# Altium schematic sheet TIDA-010933-DCAC-AUX-Power.SchDoc
size A3; Date: Not shown in title block; ApprovedBy: Not shown in title block; CheckedBy: Not shown in title block; Author: Not shown in title block; CompanyName: Not shown in title block; Engineer: Not shown in title block; Organization: Not shown in title block; Address1: Not shown in title block; Address2: Not shown in title block; Address3: Not shown in title block; Address4: Not shown in title block; DocumentNumber: 1; Revision: Use project parameter SCH_Rev; SheetNumber: 10; SheetTotal: 11; PageSetup: Record=PageOptions|CenterHorizontal=True|CenterVertical=True|PrintScale=0.69|XCorrection=1.00|YCorrection=1.00|PrintKind=0|BorderSize=5000000|LeftOffset=0|BottomOffset=0|Orientation=2|PaperLength=1000|PaperWidth=1000|Scale=100|PaperSource=15|PrintQuality=600|MediaType=1|DitherType=10|PaperKind=Letter|PrintScaleMode=1; CurrentTime: Not shown in title block; CurrentDate: Not shown in title block; Time: Not shown in title block; DocumentFullPathAndName: Not shown in title block; DocumentName: Not shown in title block; ModifiedDate: Not shown in title block; ImagePath: Not shown in title block
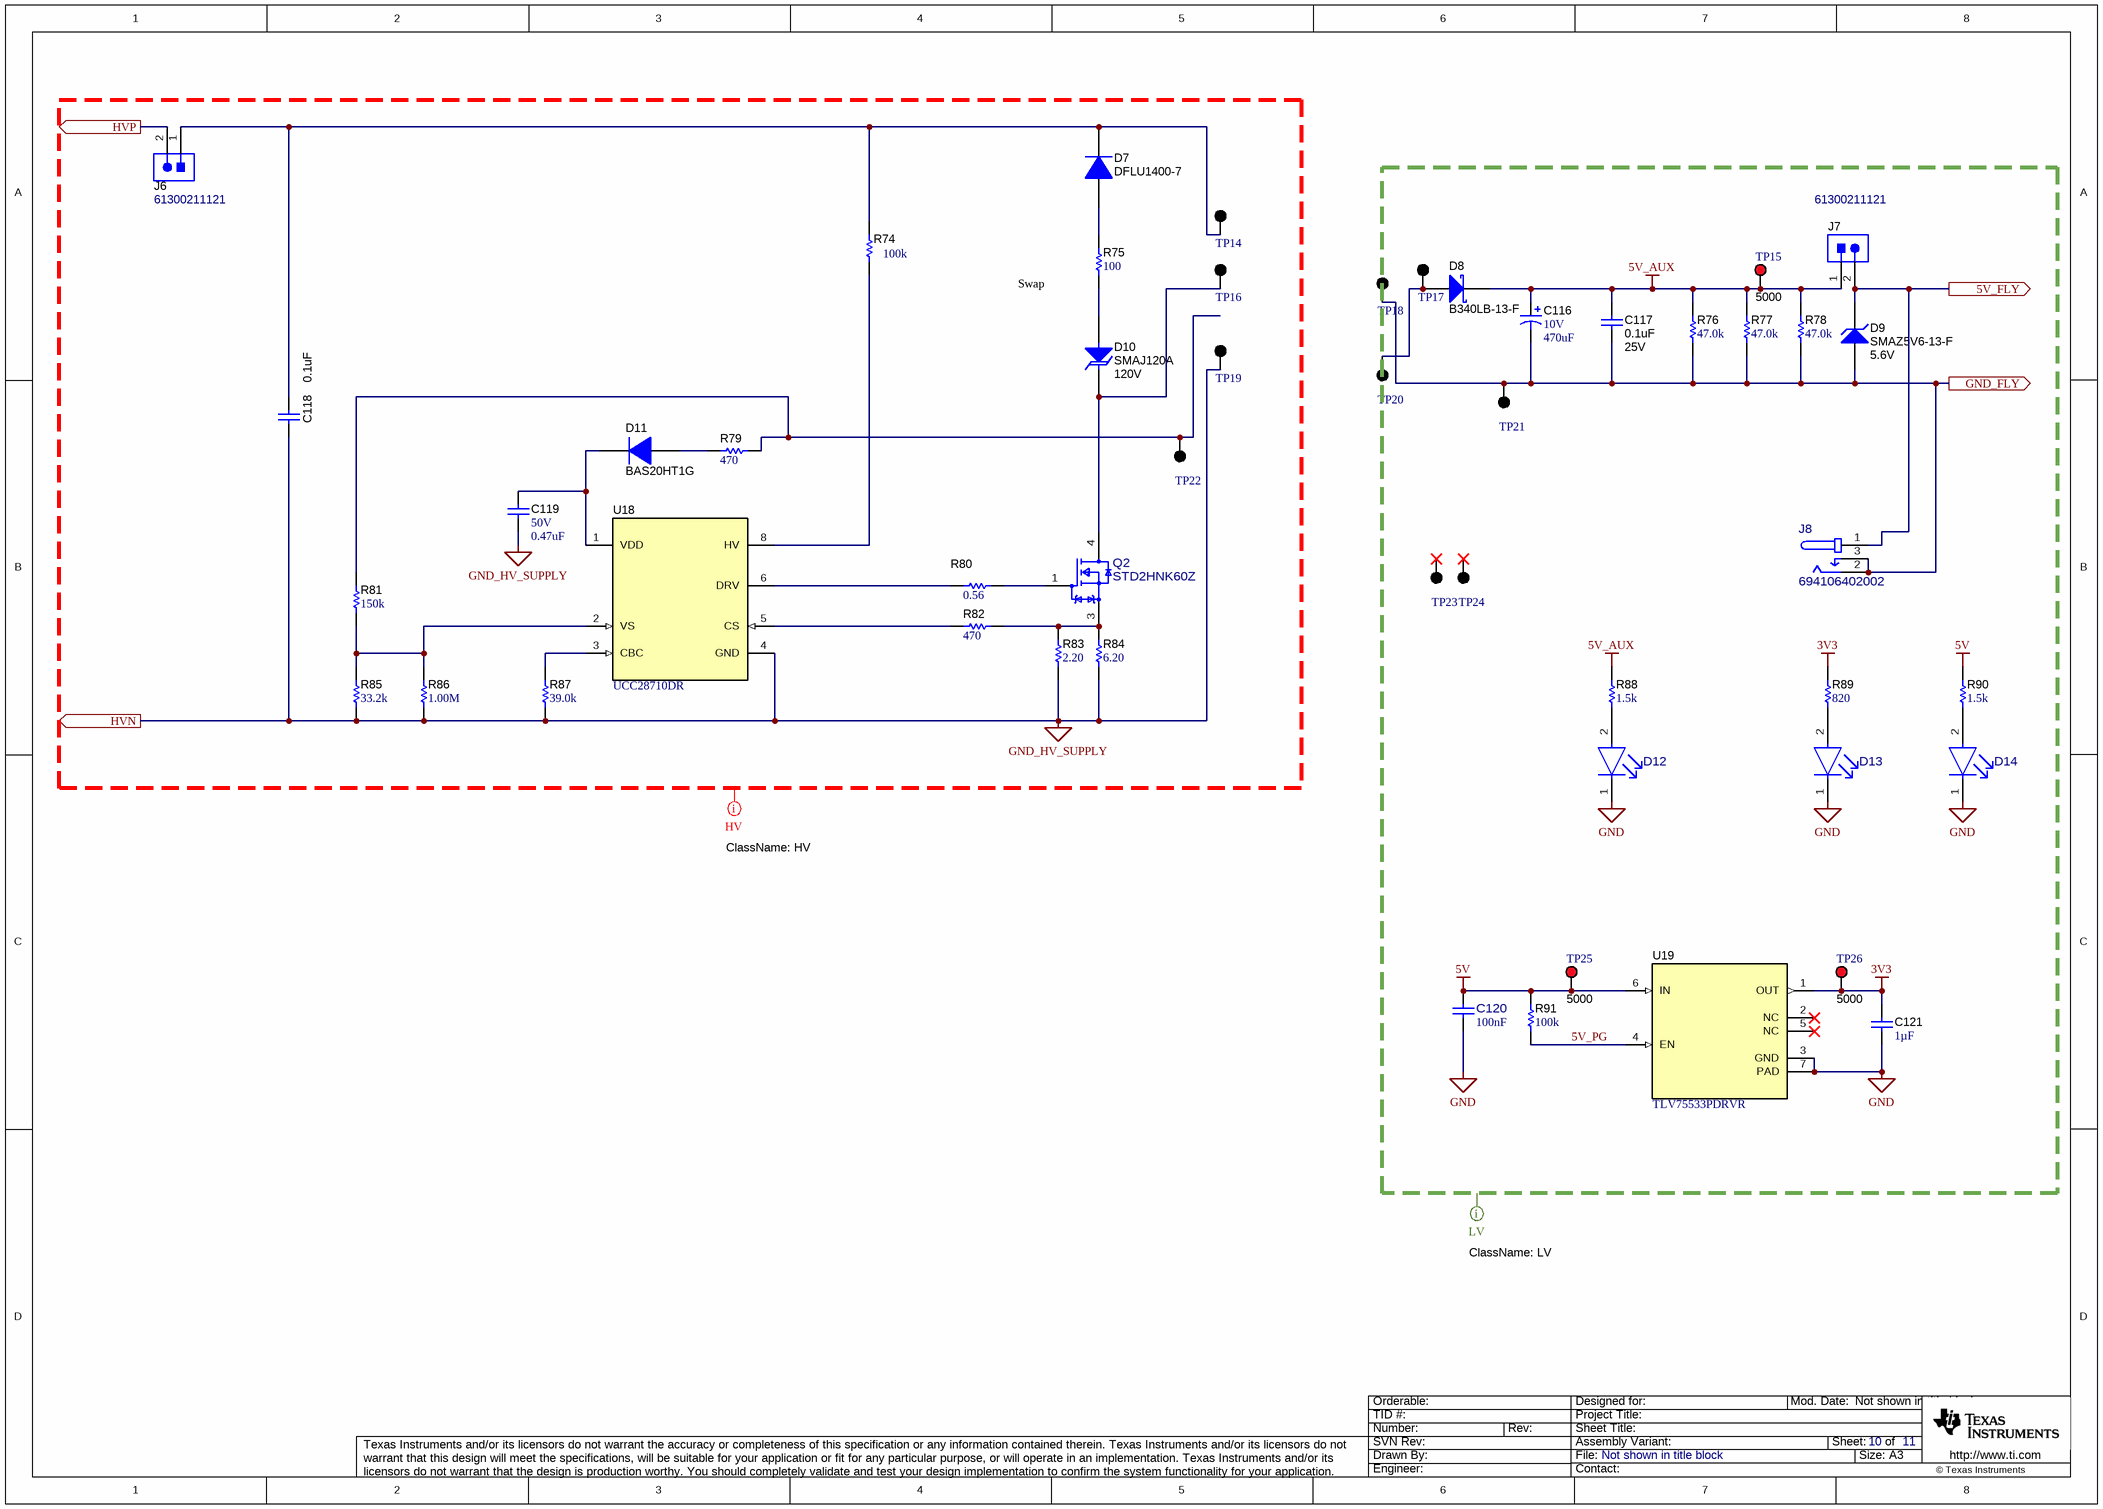
[diagram p0: TIDA-010933-DCAC-AUX-Power.SchDoc]

## Parts
C116  VDC_V: 10V  ValueDisplayed: 470uF  [7343-43]  (hidden comment: TPSE477M010R0045)
C117  ValueDisplayed: 0.1uF  VDC_V: 25V  [0603]  (hidden comment: C0603X104K3RACTU)
C118  ValueDisplayed: 0.1uF  [1812_254]  (hidden comment: C1812W104KDRACTU)
C119  VDC_V: 50V  ValueDisplayed: 0.47uF  [0805_HV]  (hidden comment: C2012X6S1H474K125AB)
C120  Cap_F: 100nF  [FP-CL10B104KB8NNNC_0603-IPC_B]  (hidden comment: CL10B104KB8NNNC)
C121  Cap_F: 1µF  [0603]  (hidden comment: 885012206026)
D7  DFLU1400-7  [PowerDI123]
D8  B340LB-13-F  [SMB]
D9  SMAZ5V6-13-F  value 5.6V  [SMA]
D10  SMAJ120A  value 120V  [SMA]
D11  BAS20HT1G  [SOD-323]
D12  KG DELLS1.22-JGKH-24  [FP-KG DELLS1.22-JGKH-24_0603-MFG]  (value not drawn)
D13  KG DELLS1.22-JGKH-24  [FP-KG DELLS1.22-JGKH-24_0603-MFG]  (value not drawn)
D14  KG DELLS1.22-JGKH-24  [FP-KG DELLS1.22-JGKH-24_0603-MFG]  (value not drawn)
J6  61300211121  [WURTH_61300211121]
J7  61300211121  [WURTH_61300211121]
J8  694106402002  [FP-694106402002_CONN_PWR_10MM7_9MM0-MFG]
Q2  STD2HNK60Z  [FP-STD2HNK60Z_DPAK-MFG]
R74  ValueDisplayed: 100k  [0805_HV]  (hidden comment: CRCW0805100KFKEA)
R75  ValueDisplayed: 100  [0805_HV]  (hidden comment: CRCW0805100RFKEA)
R76  ValueDisplayed: 47.0k  [0603]  (hidden comment: RC0603FR-0747KL)
R77  ValueDisplayed: 47.0k  [0603]  (hidden comment: RC0603FR-0747KL)
R78  ValueDisplayed: 47.0k  [0603]  (hidden comment: RC0603FR-0747KL)
R79  ValueDisplayed: 470  [0603]  (hidden comment: CRCW0603470RJNEA)
R80  ValueDisplayed: 0.56  [0603]  (hidden comment: RCWE0603R560FKEA)
R81  ValueDisplayed: 150k  [0603]  (hidden comment: RC0603FR-07150KL)
R82  ValueDisplayed: 470  [0603]  (hidden comment: RC0603FR-07470RL)
R83  ValueDisplayed: 2.20  [0805_HV]  (hidden comment: ERJ-6RQF2R2V)
R84  ValueDisplayed: 6.20  [0805_HV]  (hidden comment: RC0805FR-076R2L)
R85  ValueDisplayed: 33.2k  [0603]  (hidden comment: CRCW060333K2FKEA)
R86  ValueDisplayed: 1.00M  [0603]  (hidden comment: MCT06030C1004FP500)
R87  ValueDisplayed: 39.0k  [0603]  (hidden comment: ERJ3EKF3902V)
R88  ValueDisplayed: 1.5k  [0603]  (hidden comment: CRCW06031K50JNEA)
R89  ValueDisplayed: 820  [0603]  (hidden comment: CRCW0603820RJNEA)
R90  ValueDisplayed: 1.5k  [0603]  (hidden comment: CRCW06031K50JNEA)
R91  ValueDisplayed: 100k  [0603]  (hidden comment: RC0603FR-07100KL)
TP14  5001  [Keystone5001]  (value not drawn)
TP15  5000  [Keystone5000]
TP16  5001  [Keystone5001]  (value not drawn)
TP17  5001  [Keystone5001]  (value not drawn)
TP18  5001  [Keystone5001]  (value not drawn)
TP19  5001  [Keystone5001]  (value not drawn)
TP20  5001  [Keystone5001]  (value not drawn)
TP21  5001  [Keystone5001]  (value not drawn)
TP22  5001  [Keystone5001]  (value not drawn)
TP23  5001  [Keystone5001]  (value not drawn)
TP24  5001  [Keystone5001]  (value not drawn)
TP25  5000  [Keystone5000]
TP26  5000  [Keystone5000]
U18  UCC28710DR  [D0007A_N]
U19  TLV75533PDRVR  [DRV0006A]

## Ports
5V_FLY (out), GND_FLY (out), HVN (out), HVP (out)

## Nets
3V3: C121.1 R89.2 TP26.1 U19.1(OUT)
5V: C120.2 R90.2 R91.2 TP25.1 U19.6(IN)
5V_AUX: C116.1(+) C117.1 D8.1(K) J7.1 R76.2 R77.2 R78.2 R88.2 TP15.1
GND: C120.1 C121.2 D12.1(CATHODE) D13.1(CATHODE) D14.1(CATHODE) U19.3(GND) U19.7(PAD)
GND_HV_SUPPLY: C118.2 C119.2 R83.1 R84.1 R85.1 R86.1 R87.1 TP19.1 U18.4(GND) ; port HVN
5V_FLY: D9.1(K) J7.2 J8.1 ; port 5V_FLY
5V_PG: R91.1 U19.4(EN)
GND_FLY: C116.2(-) C117.2 D9.2(A) J8.2 J8.3 R76.1 R77.1 R78.1 TP18.1 TP21.1 ; port GND_FLY
HVP: J6.2 ; port HVP
NetC118_1: C118.1 D7.1(K) J6.1 R74.2 TP14.1
NetC119_1: C119.1 D11.1(K) U18.1(VDD)
NetD7_2: D7.2(A) R75.2
NetD8_2: D8.2(A) TP17.1 TP20.1
NetD10_1: D10.1(K) Q2.4(D) TP16.1
NetD10_2: D10.2(A) R75.1
NetD11_2: D11.2(A) R79.1
NetD12_2: D12.2(ANODE) R88.1
NetD13_2: D13.2(ANODE) R89.1
NetD14_2: D14.2(ANODE) R90.1
NetQ2_1: Q2.1(G) R80.2
NetQ2_3: Q2.3(S) R82.2 R83.2 R84.2
NetR74_1: R74.1 U18.8(HV)
NetR79_2: R79.2 R81.2 TP22.1
NetR80_1: R80.1 U18.6(DRV)
NetR81_1: R81.1 R85.2 R86.2 U18.2(VS)
NetR82_1: R82.1 U18.5(CS)
NetR87_2: R87.2 U18.3(CBC)

Not connected (* = marked no-connect by the designer): TP23 1*; TP24 1*; U19 2(NC)* 5(NC)*

## Layout directives
net class LV: 3V3, 5V, 5V_AUX, 5V_PG, GND
net class HV: GND_HV_SUPPLY

## Notes on the sheet
- Swap the resistor with D20
- Drawn By:
- SVN Rev:
- Number:
- TID #:
- Orderable:
- Rev:
- Sheet Title:
- File:
- Project Title:
- Designed for:
- Assembly Variant:
- Mod. Date:
- Sheet:
- Size:
- of
- A3
- http://www.ti.com
- Texas Instruments and/or its licensors do not warrant the accuracy or completeness of this specification or any information contained therein. Texas Instruments and/or its licensors do not warrant that this design will meet the specifications, will be suitable for your application or fit for any particular purpose, or will operate in an implementation. Texas Instruments and/or its licensors do not warrant that the design is production worthy. You should completely validate and test your design implementation to confirm the system functionality for your application.
- Engineer:
- Contact:
- © Texas Instruments

## Library data of the parts
C116 = CMP-0011981-2: CAP, TA, 470 uF, 10 V, +/- 20%, 0.045 ohm, SMD; Manufacturer: AVX; TaMin_C: -55°C; ESR_ohm: 0.045; Polarized: Y; SizeAreaWB_mm2: 58.59; U/M: EA; Value: 470uF; TaMax_C: 125°C; SizeZ_mm: 4.3; SizeX_mm: 7.3; Cap_Case: E; SizeArea_mm2: 31.39; CompType: Capacitor; Cap_F: 470µF; IRMS_A: 1.732A; AEC Category: Q200; Supplier Part Number 2: 75M2993; Publisher: Texas Instruments; Supplier 2: Newark; Supplier Part Number 3: 581-TPSE477M010R0045; Supplier 3: Mouser; RoHS: Y; Value1: 0.045 ohm; MountType: SMT; Supplier 1: Digi-Key; LatestRevisionNote: Updated supplier links; PackageReference: 7343-43; Tolerance_%: 20%; SizeY_mm: 4.3; Value2: 10V; LatestRevisionDate: 2017-03-09; PartNumber: TPSE477M010R0045; AEC Qualified: ?; Series: TPS; ComponentLink1Description: Datasheet link; Supplier Part Number 1: 478-4148-1-ND; Technology: TA; ComponentLink1URL: http://www.avx.com/docs/masterpubs/tantniob.pdf
C117 = CMP-0006979-5: CAP, CERM, 0.1 uF, 25 V, +/- 10%, X7R, 0603; Manufacturer: Kemet; Polarized: N; Value: 0.1uF; U/M: EA; Cap_F: 100nF; Value1: Unknown; TaMin_C: -55°C; TaMax_C: 125°C; AEC Category: Q200; SizeArea_mm2: 1.28; SizeAreaWB_mm2: 4.68; SizeX_mm: 1.6; SizeY_mm: 0.8; SizeZ_mm: 1; CompType: Capacitor; PartNumber: C0603X104K3RACTU; PackageReference: 0603; RoHS: Y; Tolerance_%: 10%; Value2: 25V; MountType: SMT; Technology: Ceramic; TempCo: X7R; Cap_Case: 0603; Published: 2008-06-19; Publisher: Texas Instruments; LatestRevisionDate: 2017-03-09; ComponentLink1Description: Datasheet link; ComponentLink1URL: http://www.kemet.com/kemet/web/homepage/kechome.nsf/vapubfiles/F3102_Y5V.pdf/$file/F3102_Y5V.pdf; Supplier 1: Digi-Key; Supplier Part Number 1: 399-5345-1-ND; Supplier 2: Mouser; Supplier Part Number 2: 80-C0603X104K3R; Supplier 3: Farnell; Supplier Part Number 3: 1601773; AEC Qualified: ?
C118 = CMP-0009326-2: CAP, CERM, 0.1 uF, 1000 V, +/- 10%, X7R, 1812; Manufacturer: Kemet; Polarized: N; Value: 0.1uF; U/M: EA; Cap_F: 100nF; Value1: Unknown; VDC_V: 1kV; Value2: 1000V; TaMin_C: -55°C; TaMax_C: 125°C; Cap_Case: 1812; AEC Category: Q200; SizeArea_mm2: 14.4; SizeAreaWB_mm2: 23.1; SizeX_mm: 4.5; SizeY_mm: 3.2; SizeZ_mm: 2.54; CompType: Capacitor; PartNumber: C1812W104KDRACTU; PackageReference: 1812; RoHS: Y; Tolerance_%: 10%; MountType: SMT; Technology: Ceramic; TempCo: X7R; Published: 2008-06-19; Publisher: Texas Instruments; LatestRevisionDate: 2017-03-09; ComponentLink1Description: Datasheet link; ComponentLink1URL: http://www.kemet.com/Lists/ProductCatalog/Attachments/122/KEM_C1034_X7R_HV_ARC_SMD.pdf; Supplier 1: Digi-Key; Supplier Part Number 1: 399-6523-1-ND; Supplier 2: Newark; Supplier Part Number 2: 93T1500; Supplier 3: Mouser; Supplier Part Number 3: 80-C1812W104KDR; AEC Qualified: N; AEC Grade: N/A
C119 = CMP-0007859-1: CAP, CERM, 0.47 uF, 50 V, +/- 10%, X6S, 0805; Manufacturer: TDK; TaMin_C: -55°C; ESR_ohm: 0.022012; Polarized: N; SizeAreaWB_mm2: 6.75; Value1: 0.022012 ohm; U/M: EA; Value: 0.47uF; TaMax_C: 105°C; SizeZ_mm: 1.45; SizeX_mm: 2; SizeY_mm: 1.25; Cap_Case: 0805; SizeArea_mm2: 2.5; Cap_F: 470nF; IRMS_A: 1.39566A; AEC Category: Q200; ComponentLink1URL: https://product.tdk.com/en/search/capacitor/ceramic/mlcc/info?part_no=C2012X6S1H474K125AB; Supplier Part Number 2: 810-C2012X6S1H474K125AB; Publisher: Texas Instruments; Supplier 2: Mouser; TempCo: X6S; Published: 2008-06-19; RoHS: Y; MountType: SMT; Supplier 1: Digi-Key; PackageReference: 0805; Tolerance_%: 10%; Value2: 50V; CompType: Capacitor; LatestRevisionDate: 2017-03-09; PartNumber: C2012X6S1H474K125AB; AEC Qualified: N; ComponentLink1Description: Datasheet link; AEC Grade: N/A; Supplier Part Number 1: 445-14509-1-ND; Technology: Ceramic
C120 = CMP-0087079-2: CAP CER 0.1UF 50V X7R 0603; Manufacturer: Samsung; SizeZ_mm: 0.9mm; AEC Qualified: No; TempCo: 15%; Symbol Name: SYM-CL10B104KB8NNNC; Tolerance_%: 10%; ComponentLink1Description: Datasheet; PackageReference: 0603; RoHS: TRUE; ComponentLink1URL: http://www.samsungsem.com/kr/support/product-search/mlcc/__icsFiles/afieldfile/2018/07/24/CL10B104KB8NNNC.pdf; VDC_V: 50V; PartNumber: CL10B104KB8NNNC
C121 = CMP-0064932-4: CAP, CERM, 1 uF, 10 V,+/- 10%, X7R, 0603; Manufacturer: Wurth Elektronik; TaMin_C: -55°C; Polarized: N; SizeAreaWB_mm2: 4.68; Value1: Unknown; U/M: EA; Value: 1uF; TaMax_C: 125°C; SizeZ_mm: 1; SizeX_mm: 1.6; SizeY_mm: 0.8; Value2: 10V; SizeArea_mm2: 1.28; AEC Category: Q200; Supplier Part Number 2: 15AC9362; Publisher: Texas Instruments; Supplier 2: Newark; Supplier Part Number 3: 710-885012206026; TempCo: X7R; Supplier 3: Mouser; Published: 2008-06-19; RoHS: Y; MountType: SMT; Supplier 1: Digi-Key; PackageReference: 0603; Tolerance_%: 10%; Cap_Case: 0603; CompType: Capacitor; LatestRevisionDate: 2017-06-05; PartNumber: 885012206026; AEC Qualified: N; VDC_V: 10V; ComponentLink1Description: Datasheet link; AEC Grade: N/A; Supplier Part Number 1: 732-7945-1-ND; Technology: Ceramic; ValueDisplayed: 1uF; ComponentLink1URL: http://katalog.we-online.com/pbs/datasheet/885012206026.pdf
D7 = CMP-0076896-2: Diode, Superfast Rectifier, 400 V, 1 A, PowerDI123; Manufacturer: Diodes Inc.; AEC Category: Q101; Value1: 1A; Green_Lifecycle: Not Set; TJmax_C: 150°C; SizeY_mm: 1.78; SizeZ_mm: 0.98; SizeAreaWB_mm2: 13.066; RJC_CperW: 117.0; SizeArea_mm2: 6.586; Value2: 1.25V; SizeX_mm: 3.7; Value: 400V; Green_REACh: Incomplete; Green_EU RoHS: Incomplete; MountType: SMT; ComponentLink1Description: Datasheet link; CompType: Diode; PartNumber: DFLU1400-7; Io_A: 1A; AEC Qualified: ?; PackageReference: PowerDI123; RoHS: Y; Vf_V: 1.25V; Type: Superfast Rectifier; Vr_V: 400V; ComponentLink1URL: http://www.diodes.com/datasheets/ds30784.pdf; Green_EU RoHS-2: Incomplete
D8 = CMP-0028414-2: Diode, Schottky, 40 V, 3 A, SMB; Manufacturer: Diodes Inc.; Value: 40V; SizeZ_mm: 2.6; SizeAreaWB_mm2: 44.156; SizeY_mm: 3.81; Io_A: 3A; Green_REACh: Incomplete; SizeArea_mm2: 21.336; Vf_V: 450mV; Green_Lifecycle: Not Set; RJC_CperW: 25; TJmax_C: 125°C; SizeX_mm: 5.6; Value2: 0.45V; AEC Category: Q101; CompType: Diode; Type: Schottky; Value1: 3A; Green_EU RoHS: Incomplete; Green_EU RoHS-2: Incomplete; AEC Qualified: ?; MountType: SMT; Vr_V: 40V; PartNumber: B340LB-13-F; PackageReference: SMB; RoHS: Y; ComponentLink1URL: http://www.diodes.com/datasheets/ds30240.pdf; ComponentLink1Description: Datasheet link
D9 = CMP-0005533-3: Diode, Zener, 5.6 V, 1 W, SMA; Manufacturer: Diodes Inc.; SizeZ_mm: 2.87; SizeArea_mm2: 16.3228; AEC Category: Q101; SizeAreaWB_mm2: 37.3428; SizeX_mm: 5.59; AEC Qualified: N; RJA_CperW: 125; Power_W: 1W; SizeY_mm: 2.92; MountType: SMT; CompType: Zener; PackageReference: SMA; ComponentLink1URL: http://www.diodes.com/datasheets/ds18015.pdf; ComponentLink1Description: Datasheet link; PartNumber: SMAZ5V6-13-F; RoHS: Y; Vz_V: 5.6V; Value1: 1W
D10 = CMP-0084980-1: Diode, TVS, Uni, 120 V, 193 Vc, 400 W, 2.1 A, SMA; Manufacturer: Littelfuse; SizeX_mm: 5.59; Vc: 193V; Ipp: 2.1A; Vbr_Max: 147V; AEC Qualified: N; Vbr_Min: 133V; SizeY_mm: 2.92; Ppk: 400W; SizeZ_mm: 2.87; AEC Category: Q101; SizeAreaWB_mm2: 37.3428; RJA_CperW: 120; SizeArea_mm2: 16.3228; RoHS: Y; VRWM: 120V; ComponentLink1Description: Datasheet link; MountType: SMT; PartNumber: SMAJ120A; PackageReference: SMA; ComponentLink1URL: https://www.littelfuse.com/~/media/electronics/datasheets/tvs_diodes/littelfuse_tvs_diode_smaj_datasheet.pdf.pdf; Value1: 193V; CompType: TVS
D11 = CMP-0029150-2: Diode, Switching, 200 V, 0.2 A, AEC-Q101, SOD-323; Manufacturer: ON Semiconductor; Value2: 1.25V; Value1: 0.2A; SizeZ_mm: 1; Green_REACh: Incomplete; SizeArea_mm2: 3.645; Vr_V: 200V; SizeX_mm: 2.7; TJmax_C: 150°C; Io_A: 200mA; Value: 200V; Green_Lifecycle: Not Set; SizeAreaWB_mm2: 8.695; AEC Qualified: Y; AEC Category: Q101; SizeY_mm: 1.35; MountType: SMT; Vf_V: 1.25V; ComponentLink1URL: http://www.onsemi.com/pub_link/Collateral/BAS20HT1-D.PDF; Type: Switching; PackageReference: SOD-323; CompType: Diode; PartNumber: BAS20HT1G; Green_EU RoHS: Incomplete; Green_EU RoHS-2: Incomplete; RoHS: Y; ComponentLink1Description: Datasheet link
D12-D14 = CMP-0093310-1: Standard LEDs - SMD Green TOPLED E 1608; Manufacturer: Osram Opto; AEC Grade: Grade 2; LambdaP: 572nm; SizeZ_mm: 0.7mm; LuminousFlux_PhiV: 0.016-0.0295lm; Luminous Intensity: 4.5-9.7mcd; LambdaD: 570nm; Tjmax_C: 125°C; Angle: 120°; Led Orientation: Top View; Forward Current: 2mA; Vf_V: 1.8V; AEC Qualified: Yes; Vr_V: 12V; Lead Free: Yes; Part Number: KG DELLS1.22-JGKH-24; ComponentLink1URL: https://dammedia.osram.info/media/resource/hires/osram-dam-5423212/KG%20DELLS1.22_EN.pdf; Mouser Description: Topled E1608 Grn SMT; helpURL: https://upverter.com/upn/revision/bca93164397fc6ea/; PackageReference: 0603; ComponentLink1Description: Datasheet; PartNumber: KG DELLS1.22-JGKH-24; Datasheet Path: datasheets/Diode-KG DELLS1.22-JGKH-24.pdf; RoHS: TRUE; Mouser Part Number: 720-KGDELLS122A4849; Operating Temperature Range: -40°C to +110°C; datasheet: https://dammedia.osram.info/media/resource/hires/osram-dam-5423212/KG%20DELLS1.22_EN.pdf; Color: Green
J6 J7 = CMP-0054794-2: Header, 2.54 mm, 2x1, Gold, TH; Manufacturer: Wurth Elektronik; Green_Lifecycle: Active; Green_REACh: Passed; Cert_UL: Y; Gender: Male; Pitch_mm: 2.54; Row_Count: 1; Shrouded: N; ComponentLink1URL: http://katalog.we-online.de/em/datasheet/6130xx11121.pdf; ClassName: Header; Supplier Part Number 2: 20X0948; Supplier 2: Newark; Supplier Part Number 3: 710-61300211121; Supplier 3: Mouser; RoHS: Y; MountType: TH; Green_EU RoHS-2: Incomplete; Supplier 1: Digi-Key; Green_EU RoHS: Passed; PackageReference: Header, 2.54mm, 2x1, TH; CompType: Header; PartNumber: 61300211121; ComponentLink1Description: Datasheet URL; Supplier Part Number 1: 732-5315-ND; Color: Black; ContactFinish: Gold; Orientation: Vertical; PinCount: 2
J8 = CMP-0040211-1: Power Barrel Connector Jack 2.10mm ID (0.083"), 5.50mm OD (0.217") Through Hole; Manufacturer: Wurth Electronics; ContactFinish: Gold; Current_A: 3A; Voltage_V: 30V; AEC Qualified: No; Conn Gender: Female; Conn Orientation: Vertical; SizeZ_mm: 14.3mm; PackageReference: CONN_PWR_10MM7_9MM0; PartNumber: 694106402002; PinCount: 1; RoHS: TRUE; Supplier 1: Digikey; Supplier 2: Mouser; Supplier Part Number 1: 732-5931-ND; Supplier Part Number 2: 710-694106402002; Part Number: 694106402002; datasheet: https://www.we-online.com/components/products/datasheet/694106402002.pdf; Datasheet Path: datasheets/Conn-694106402002.pdf; Digikey Description: CONN PWR JACK 2.1X5.5MM SOLDER; Digikey Part Number: 732-5931-ND; helpURL: https://upverter.com/upn/revision/1809d497b2602ff5/; Lead Free: Yes; Mouser Description: DC Power Jack Connector WR-DC, Male, Vertical, THT, 3 A, 20 V; Mouser Part Number: 710-694106402002; Operating Temperature Range: -40°C to +85°C; ComponentLink1Description: Datasheet; ComponentLink1URL: https://www.we-online.com/components/products/datasheet/694106402002.pdf
Q2 = CMP-0036768-1: MOSFET N-Channel 600 V 2A (Tc) 45W (Tc) Surface Mount DPAK; Manufacturer: STMicroelectronics; AEC Qualified: No; QgTyp_nC: 11nC @ 10V; Rdson45_ohm: 3.5; SizeZ_mm: 2.48mm; VdsMax_V: 1.6V; Vgs_V: 30V; ChMode: False; Drain To Source Breakdown Voltage: 600V; Input Capacitace At Vds: 280pF @ 25V; Number Of Channels: 1; Pulse Drain Current: 8A; Reverse Recovery Charge: 445nC; Reverse Recovery Time: 178ns; Rthja Max: 100°C/W; Standoff Height: 0mm; Threshold Vgs Max: 4.5V; Threshold Vgs Min: 3V; TJmax_C: +150°C; Turn Off Delay Time: 23ns; Turn On Delay Time: 10ns; IdsMax_A: 2A; PackageReference: DPAK; PartNumber: STD2HNK60Z; RoHS: TRUE; Part Number: STD2HNK60Z; datasheet: https://www.st.com/resource/en/datasheet/std2hnk60z.pdf; Datasheet Path: datasheets/Trans-STD2HNK60Z.pdf; Digikey Description: MOSFET N-CH 600V 2A DPAK; Digikey Part Number: 497-6192-1-ND; helpURL: https://upverter.com/upn/revision/b69afbc3f4c1a412/; Lead Free: Yes; Mouser Description: N-channel 600 V - 4.4 O - 2 A - TO-92/TO-220FP/DPAK/IPAK Zener-protected SuperMESH™2; Power MOSFET; Mouser Part Number: 511-STD2HNK60Z; Number Of N Channels: 1; Operating Temperature Range: -55°C to +150°C; Power_W: 45W; ComponentLink1Description: Datasheet; ComponentLink1URL: https://www.st.com/resource/en/datasheet/std2hnk60z.pdf
R74 = CMP-0020834-3: RES, 100 k, 1%, 0.125 W, AEC-Q200 Grade 0, 0805; Manufacturer: Vishay-Dale; Power_W: 125mW; TempCo: 100 ppm/C; Value: 100k; EIA_Code: E96; SizeX_mm: 2; SizeY_mm: 1.25; SizeZ_mm: 1.45; Value2: 0.125W; SizeArea_mm2: 2.5; AEC Qualified: Y; VDC_V: 150V; AEC Category: Q200; AEC Grade: 0; Supplier Part Number 2: 52K9808; Supplier 2: Newark; Supplier Part Number 3: 71-CRCW0805-100K-E3; Supplier 3: Mouser; Value_Code: 100k; RoHS: E; Value1: 1%; MountType: SMT; Supplier 1: Digi-Key; PackageReference: 0805; Tolerance_%: 1%; Res_ohm: 100k; CompType: Resistor; PartNumber: CRCW0805100KFKEA; ComponentLink1Description: Datasheet link; Supplier Part Number 1: 541-100KCCT-ND; Technology: Thick Film; ComponentLink1URL: http://www.vishay.com/docs/20035/dcrcwe3.pdf
R75 = CMP-0020835-3: RES, 100, 1%, 0.125 W, AEC-Q200 Grade 0, 0805; Manufacturer: Vishay-Dale; Power_W: 125mW; TempCo: 100 ppm/C; Value_Code: 100R; Value: 100; EIA_Code: E96; SizeX_mm: 2; SizeY_mm: 1.25; SizeZ_mm: 1.45; Value2: 0.125W; SizeArea_mm2: 2.5; AEC Qualified: Y; VDC_V: 150V; AEC Category: Q200; AEC Grade: 0; Supplier Part Number 2: 52K9809; Supplier 2: Newark; Supplier Part Number 3: 71-CRCW0805-100-E3; Supplier 3: Mouser; RoHS: E; Value1: 1%; MountType: SMT; Supplier 1: Digi-Key; PackageReference: 0805; Tolerance_%: 1%; Res_ohm: 100; CompType: Resistor; PartNumber: CRCW0805100RFKEA; ComponentLink1Description: Datasheet link; Supplier Part Number 1: 541-100CCT-ND; Technology: Thick Film; ComponentLink1URL: http://www.vishay.com/docs/20035/dcrcwe3.pdf
R76-R78 = CMP-0023133-5: RES, 47.0 k, 1%, 0.1 W, 0603; Manufacturer: Yageo; Power_W: 100mW; TempCo: 100 ppm/C; Value_Code: 47k0; Value: 47.0k; Res_ohm: 47k; SizeX_mm: 1.6; SizeY_mm: 0.8; SizeZ_mm: 1; Value2: 0.1W; SizeArea_mm2: 1.28; AEC Qualified: N; VDC_V: 75V; AEC Category: Q200; SizeAreaWB_mm2: 4.68; Supplier Part Number 2: 603-RC0603FR-0747KL; Supplier 2: Mouser; Supplier Part Number 3: 9238689; Supplier 3: Farnell; RoHS: Y; Value1: 1%; MountType: SMT; Supplier 1: Digi-Key; PackageReference: 0603; Tolerance_%: 1%; CompType: Resistor; PartNumber: RC0603FR-0747KL; ComponentLink1Description: Datasheet link; Supplier Part Number 1: 311-47.0KHRCT-ND; Technology: Thick Film; ComponentLink1URL: http://www.yageo.com/pdf/Pu-RC0603_51_PbFree_L_2.pdf; AEC Grade: N/A
R79 = CMP-0025813-4: RES, 470, 5%, 0.1 W, AEC-Q200 Grade 0, 0603; Manufacturer: Vishay-Dale; Power_W: 100mW; TempCo: 200 ppm/C; Value_Code: 470R; Value: 470; EIA_Code: E24; SizeX_mm: 1.6; SizeY_mm: 0.8; SizeZ_mm: 1; Value2: 0.1W; SizeArea_mm2: 1.28; AEC Qualified: Y; VDC_V: 75V; AEC Category: Q200; AEC Grade: 0; Supplier Part Number 2: 59M6817; Supplier 2: Newark; Supplier Part Number 3: 71-CRCW0603J-470-E3; Supplier 3: Mouser; RoHS: E; Value1: 5%; MountType: SMT; Supplier 1: Digi-Key; PackageReference: 0603; Tolerance_%: 5%; Res_ohm: 470; CompType: Resistor; PartNumber: CRCW0603470RJNEA; ComponentLink1Description: Datasheet link; Supplier Part Number 1: 541-470GCT-ND; Technology: Thick Film; ComponentLink1URL: http://www.vishay.com/docs/20035/dcrcwe3.pdf
R80 = CMP-0081726-1: RES, 0.56, 1%, 0.2 W, AEC-Q200 Grade 0, 0603; Manufacturer: Vishay-Dale; Power_W: 200mW; TempCo: 100 ppm/C; SizeAreaWB_mm2: 4.68; Value_Code: R560; Value: 0.56; EIA_Code: E96; SizeX_mm: 1.6; SizeY_mm: 0.8; SizeZ_mm: 1; Value2: 0.2W; SizeArea_mm2: 1.28; AEC Qualified: Y; AEC Grade: 0; AEC Category: Q200; ComponentLink1URL: http://www.vishay.com/docs/20019/rcwe.pdf; Supplier Part Number 2: 71-RCWE0603R560FKEA; Supplier 2: Mouser; RoHS: Y; Value1: 1%; MountType: SMT; Supplier 1: Digi-Key; PackageReference: 0603; Tolerance_%: 1%; Res_ohm: 0.56; CompType: Resistor; PartNumber: RCWE0603R560FKEA; ComponentLink1Description: Datasheet link; Supplier Part Number 1: RCWE.56CCT-ND; Technology: Thick Film
R81 = CMP-0022808-4: RES, 150 k, 1%, 0.1 W, 0603; Manufacturer: Yageo; Power_W: 100mW; TempCo: 100 ppm/C; Value: 150k; EIA_Code: E96; SizeX_mm: 1.6; SizeY_mm: 0.8; SizeZ_mm: 1; Value2: 0.1W; SizeArea_mm2: 1.28; AEC Qualified: N; VDC_V: 75V; AEC Category: Q200; SizeAreaWB_mm2: 4.68; ComponentLink1URL: http://www.yageo.com/pdf/Pu-RC0603_51_PbFree_L_2.pdf; Supplier Part Number 2: 603-RC0603FR-07150KL; Supplier 2: Mouser; Supplier Part Number 3: 9238743; Supplier 3: Farnell; Value_Code: 150k; RoHS: Y; Value1: 1%; MountType: SMT; Supplier 1: Digi-Key; PackageReference: 0603; Tolerance_%: 1%; Res_ohm: 150k; CompType: Resistor; PartNumber: RC0603FR-07150KL; ComponentLink1Description: Datasheet link; Supplier Part Number 1: 311-150KHRCT-ND; Technology: Thick Film; AEC Grade: N/A
R82 = CMP-0023129-5: RES, 470, 1%, 0.1 W, 0603; Manufacturer: Yageo; Power_W: 100mW; TempCo: 100 ppm/C; Value_Code: 470R; Value: 470; SizeX_mm: 1.6; SizeY_mm: 0.8; SizeZ_mm: 1; Value2: 0.1W; SizeArea_mm2: 1.28; AEC Qualified: N; VDC_V: 75V; AEC Category: Q200; SizeAreaWB_mm2: 4.68; Supplier Part Number 2: 603-RC0603FR-07470RL; Supplier 2: Mouser; Supplier Part Number 3: 9238441; Supplier 3: Farnell; RoHS: Y; Value1: 1%; MountType: SMT; Supplier 1: Digi-Key; PackageReference: 0603; Tolerance_%: 1%; Res_ohm: 470; CompType: Resistor; PartNumber: RC0603FR-07470RL; ComponentLink1Description: Datasheet link; Supplier Part Number 1: 311-470HRCT-ND; Technology: Thick Film; ComponentLink1URL: http://www.yageo.com/pdf/Pu-RC0603_51_PbFree_L_2.pdf; AEC Grade: N/A
R83 = CMP-0021828-3: RES, 2.20, 1%, 0.125 W, AEC-Q200 Grade 0, 0805; Manufacturer: Panasonic; Power_W: 125mW; TempCo: 200 ppm/C; Value_Code: 2R20; Value: 2.20; Res_ohm: 2.2; SizeX_mm: 2; SizeY_mm: 1.25; SizeZ_mm: 1.45; Value2: 0.125W; SizeArea_mm2: 2.5; AEC Qualified: Y; AEC Category: Q200; AEC Grade: 0; SizeAreaWB_mm2: 6.75; Supplier Part Number 2: 667-ERJ-6RQF2R2V; Supplier 2: Mouser; Supplier Part Number 3: 1717803; Supplier 3: Farnell; RoHS: Y; Value1: 1%; MountType: SMT; Supplier 1: Digi-Key; PackageReference: 0805; Tolerance_%: 1%; CompType: Resistor; PartNumber: ERJ-6RQF2R2V; ComponentLink1Description: Datasheet link; Supplier Part Number 1: P2.2DCT-ND; Technology: Thick Film; ComponentLink1URL: https://industrial.panasonic.com/cdbs/www-data/pdf/RDN0000/AOA0000C313.pdf
R84 = CMP-0021950-2: RES, 6.20, 1%, 0.125 W, 0805; Manufacturer: Yageo America; Power_W: 125mW; TempCo: 200 ppm/C; Value_Code: 6R20; U/M: EA; Value: 6.20; Res_ohm: 6.2; SizeX_mm: 2; SizeY_mm: 1.25; SizeZ_mm: 1.45; Value2: 0.125W; SizeArea_mm2: 2.5; VDC_V: 150V; AEC Category: Q200; Supplier Part Number 2: 603-RC0805FR-076R2L; Publisher: Texas Instruments; Supplier 2: Mouser; Supplier Part Number 3: 1117414; Supplier 3: Farnell; Published: 2008-06-26; RoHS: Y; Value1: 1%; MountType: SMT; Supplier 1: Digi-Key; PackageReference: 0805; Tolerance_%: 1%; CompType: Resistor; LatestRevisionDate: 2017-03-09; PartNumber: RC0805FR-076R2L; AEC Qualified: ?; ComponentLink1Description: Datasheet link; Supplier Part Number 1: 311-6.20CRCT-ND; Technology: Thick Film; ComponentLink1URL: http://www.yageo.com/pdf/Pu-RC0805_51_PbFree_L_2.pdf
R85 = CMP-0022339-4: RES, 33.2 k, 1%, 0.1 W, AEC-Q200 Grade 0, 0603; Manufacturer: Vishay-Dale; Power_W: 100mW; TempCo: 100 ppm/C; Value_Code: 33k2; Value: 33.2k; EIA_Code: E96; SizeX_mm: 1.6; SizeY_mm: 0.8; SizeZ_mm: 1; Value2: 0.1W; SizeArea_mm2: 1.28; AEC Qualified: Y; VDC_V: 75V; AEC Category: Q200; AEC Grade: 0; Supplier Part Number 2: 71-CRCW0603-33.2K-E3; Supplier 2: Mouser; Supplier Part Number 3: 1692523; Supplier 3: Farnell; RoHS: E; Value1: 1%; MountType: SMT; Supplier 1: Digi-Key; PackageReference: 0603; Tolerance_%: 1%; Res_ohm: 33.2k; CompType: Resistor; PartNumber: CRCW060333K2FKEA; ComponentLink1Description: Datasheet link; Supplier Part Number 1: 541-33.2KHCT-ND; Technology: Thick Film; ComponentLink1URL: http://www.vishay.com/docs/20035/dcrcwe3.pdf
R86 = CMP-0022731-2: RES, 1.00 M, 1%, 0.125 W, 0603; Manufacturer: Vishay/Beyschlag; Power_W: 125mW; TempCo: 50 ppm/C; Value_Code: 1M00; U/M: EA; Value: 1.00Meg; EIA_Code: E96; Res_ohm: 1M; SizeX_mm: 1.6; SizeY_mm: 0.8; SizeZ_mm: 1; Value2: 0.125W; SizeArea_mm2: 1.28; AEC Qualified: N; VDC_V: 75V; AEC Category: Q200; ComponentLink1URL: http://www.vishay.com/docs/28705/mcx0x0xpro.pdf; Supplier Part Number 2: 06X5971; Publisher: Texas Instruments; Supplier 2: Newark; Supplier Part Number 3: 594-MCT06030C1004FP5; Supplier 3: Mouser; Published: 2008-06-26; RoHS: Y; Value1: 1%; MountType: SMT; Supplier 1: Digi-Key; PackageReference: 0603; Tolerance_%: 1%; CompType: Resistor; LatestRevisionDate: 2017-03-09; PartNumber: MCT06030C1004FP500; ComponentLink1Description: Datasheet link; AEC Grade: N/A; Supplier Part Number 1: MCT0603-1.00M-CFCT-ND; Technology: Thin Film
R87 = CMP-0078665-1: RES, 39.0 k, 1%, 0.1 W, AEC-Q200 Grade 0, 0603; Manufacturer: Panasonic; Power_W: 100mW; TempCo: 100 ppm/C; Value_Code: 39k0; Value: 39.0k; Res_ohm: 39k; SizeX_mm: 1.6; SizeY_mm: 0.8; SizeZ_mm: 1; Value2: 0.1W; SizeArea_mm2: 1.28; AEC Qualified: Y; AEC Grade: 0; AEC Category: Q200; ComponentLink1URL: https://industrial.panasonic.com/cdbs/www-data/pdf/RDA0000/AOA0000C304.pdf; Supplier Part Number 2: 64R5345; Supplier 2: Newark; Supplier Part Number 3: 667-ERJ-3EKF3902V; Supplier 3: Mouser; RoHS: Y; Value1: 1%; MountType: SMT; Supplier 1: Digi-Key; PackageReference: 0603; Tolerance_%: 1%; CompType: Resistor; PartNumber: ERJ3EKF3902V; ComponentLink1Description: Datasheet link; Supplier Part Number 1: P39.0KHCT-ND; Technology: Thick Film
R88 R90 = CMP-0025733-4: RES, 1.5 k, 5%, 0.1 W, AEC-Q200 Grade 0, 0603; Manufacturer: Vishay-Dale; Power_W: 100mW; TempCo: 200 ppm/C; Value_Code: 1k50; Value: 1.5k; EIA_Code: E24; SizeX_mm: 1.6; SizeY_mm: 0.8; SizeZ_mm: 1; Value2: 0.1W; SizeArea_mm2: 1.28; AEC Qualified: Y; VDC_V: 75V; AEC Category: Q200; AEC Grade: 0; Supplier Part Number 2: 59M6753; Supplier 2: Newark; Supplier Part Number 3: 71-CRCW0603J-1.5K-E3; Supplier 3: Mouser; RoHS: E; Value1: 5%; MountType: SMT; Supplier 1: Digi-Key; PackageReference: 0603; Tolerance_%: 5%; Res_ohm: 1.5k; CompType: Resistor; PartNumber: CRCW06031K50JNEA; ComponentLink1Description: Datasheet link; Supplier Part Number 1: 541-1.5KGCT-ND; Technology: Thick Film; ComponentLink1URL: http://www.vishay.com/docs/20035/dcrcwe3.pdf
R89 = CMP-0025859-4: RES, 820, 5%, 0.1 W, AEC-Q200 Grade 0, 0603; Manufacturer: Vishay-Dale; Power_W: 100mW; TempCo: 200 ppm/C; Value_Code: 820R; Value: 820; EIA_Code: E24; SizeX_mm: 1.6; SizeY_mm: 0.8; SizeZ_mm: 1; Value2: 0.1W; SizeArea_mm2: 1.28; AEC Qualified: Y; VDC_V: 75V; AEC Category: Q200; AEC Grade: 0; Supplier Part Number 2: 59M8581; Supplier 2: Newark; Supplier Part Number 3: 71-CRCW0603J-820-E3; Supplier 3: Mouser; RoHS: E; Value1: 5%; MountType: SMT; Supplier 1: Digi-Key; PackageReference: 0603; Tolerance_%: 5%; Res_ohm: 820; CompType: Resistor; PartNumber: CRCW0603820RJNEA; ComponentLink1Description: Datasheet link; Supplier Part Number 1: 541-820GCT-ND; Technology: Thick Film; ComponentLink1URL: http://www.vishay.com/docs/20035/dcrcwe3.pdf
R91 = CMP-0022735-5: RES, 100 k, 1%, 0.1 W, 0603; Manufacturer: Yageo; Power_W: 100mW; TempCo: 100 ppm/C; Value: 100k; EIA_Code: E96; SizeX_mm: 1.6; SizeY_mm: 0.8; SizeZ_mm: 1; Value2: 0.1W; SizeArea_mm2: 1.28; AEC Qualified: N; VDC_V: 75V; AEC Category: Q200; SizeAreaWB_mm2: 4.68; Supplier Part Number 2: 603-RC0603FR-07100KL; Supplier 2: Mouser; Supplier Part Number 3: 9238727; Supplier 3: Farnell; Value_Code: 100k; RoHS: Y; Value1: 1%; MountType: SMT; Supplier 1: Digi-Key; PackageReference: 0603; Tolerance_%: 1%; Res_ohm: 100k; CompType: Resistor; PartNumber: RC0603FR-07100KL; ComponentLink1Description: Datasheet link; Supplier Part Number 1: 311-100KHRCT-ND; Technology: Thick Film; ComponentLink1URL: http://www.yageo.com/pdf/Pu-RC0603_51_PbFree_L_2.pdf; AEC Grade: N/A
TP14 TP16-TP24 = CMP-0055138-2: Test Point, Miniature, Black, TH; Manufacturer: Keystone Electronics; ContactFinish: Silver; CNHeader: FALSE; Green_Lifecycle: Active; Green_REACh: Passed; CT: TRUE; Color: Black; PackageReference: Black Miniature Testpoint; LatestRevisionDate: 26/05/2017; MountType: TH; Publisher: Texas Instruments; Green_EU RoHS-2: Incomplete; PartNumber: 5001; Supplier 1: Digi-Key; Supplier Part Number 1: 36-5001-ND; ComponentLink1URL: http://www.keyelco.com/userAssets/file/M60-2p60.pdf; ComponentLink1Description: Datasheet URL; RoHS: Y; Supplier 2: Mouser; Green_EU RoHS: Passed; CompType: Test Point; Supplier Part Number 2: 534-5001
TP15 TP25 TP26 = CMP-0055137-2: Test Point, Miniature, Red, TH; Manufacturer: Keystone Electronics; Green_REACh: Passed; Green_Lifecycle: Active; ContactFinish: Silver; CNHeader: FALSE; CT: TRUE; Green_EU RoHS-2: Incomplete; Supplier 2: Mouser; PackageReference: Red Miniature Testpoint; MountType: TH; PartNumber: 5000; LatestRevisionDate: 26/05/2017; RoHS: Y; Publisher: Texas Instruments; ComponentLink1URL: http://www.keyelco.com/userAssets/file/M60-2p60.pdf; ComponentLink1Description: Datasheet URL; CompType: Test Point; Supplier Part Number 1: 36-5000-ND; Supplier 1: Digi-Key; Green_EU RoHS: Passed; Color: Red; Supplier Part Number 2: 534-5000
U18 = CMP-0067230-2: Constant-Voltage, Constant-Current PWM Controller with Primary-Side Regulation, D0007A (SOIC-7); Alternate Manufacturer: Texas Instruments; SizeAreaWB_mm2: 55.2; U/M: EA; SizeZ_mm: 1.75; SizeX_mm: 6.0; SizeY_mm: 4.9; SizeArea_mm2: 29.4; CompType: IC; AEC Category: Q200; AEC Qualified: N; ComponentLink1URL: http://www.ti.com/lit/ds/symlink/ucc28710.pdf; Alternate PartNumber: UCC28710D; PackageDescription: SOIC-7; RoHS: Y; MountType: SMT; Manufacturer: Texas Instruments; PackageReference: D0007A; PartNumber: UCC28710DR; ComponentLink1Description: Datasheet Link; ComponentLink2Description: Product Folder; ComponentLink2URL: http://www.ti.com/product/ucc28710
U19 = CMP-0013427-7: 500mA LDO, DRV0006A (WSON-6); Manufacturer: Texas Instruments; SizeX_mm: 2; CompType: IC; SizeZ_mm: 0.8; SizeArea_mm2: 4; SizeAreaWB_mm2: 9; U/M: EA; PackageDescription: WSON-6; PartNumber: TLV75533PDRVR; ComponentLink1URL: https://sps16.itg.ti.com/sites/KMS/crossdivteams/altium/docs/ComponentDatasheets/SBVS320_TLV755_8_3.pdf; ComponentLink1Description: Datasheet Link; LatestRevisionDate: 2017-03-09; SizeY_mm: 2; Publisher: Texas Instruments; PackageReference: DRV0006A; MountType: SMT; Alternate Manufacturer: Texas Instruments